# Altium schematic sheet ADC.SchDoc
size Tabloid; Organization: Altium Limited; Address1: L3, 12a Rodborough Rd; Address2: Frenchs Forest; Address3: NSW; Address4: Australia 2086
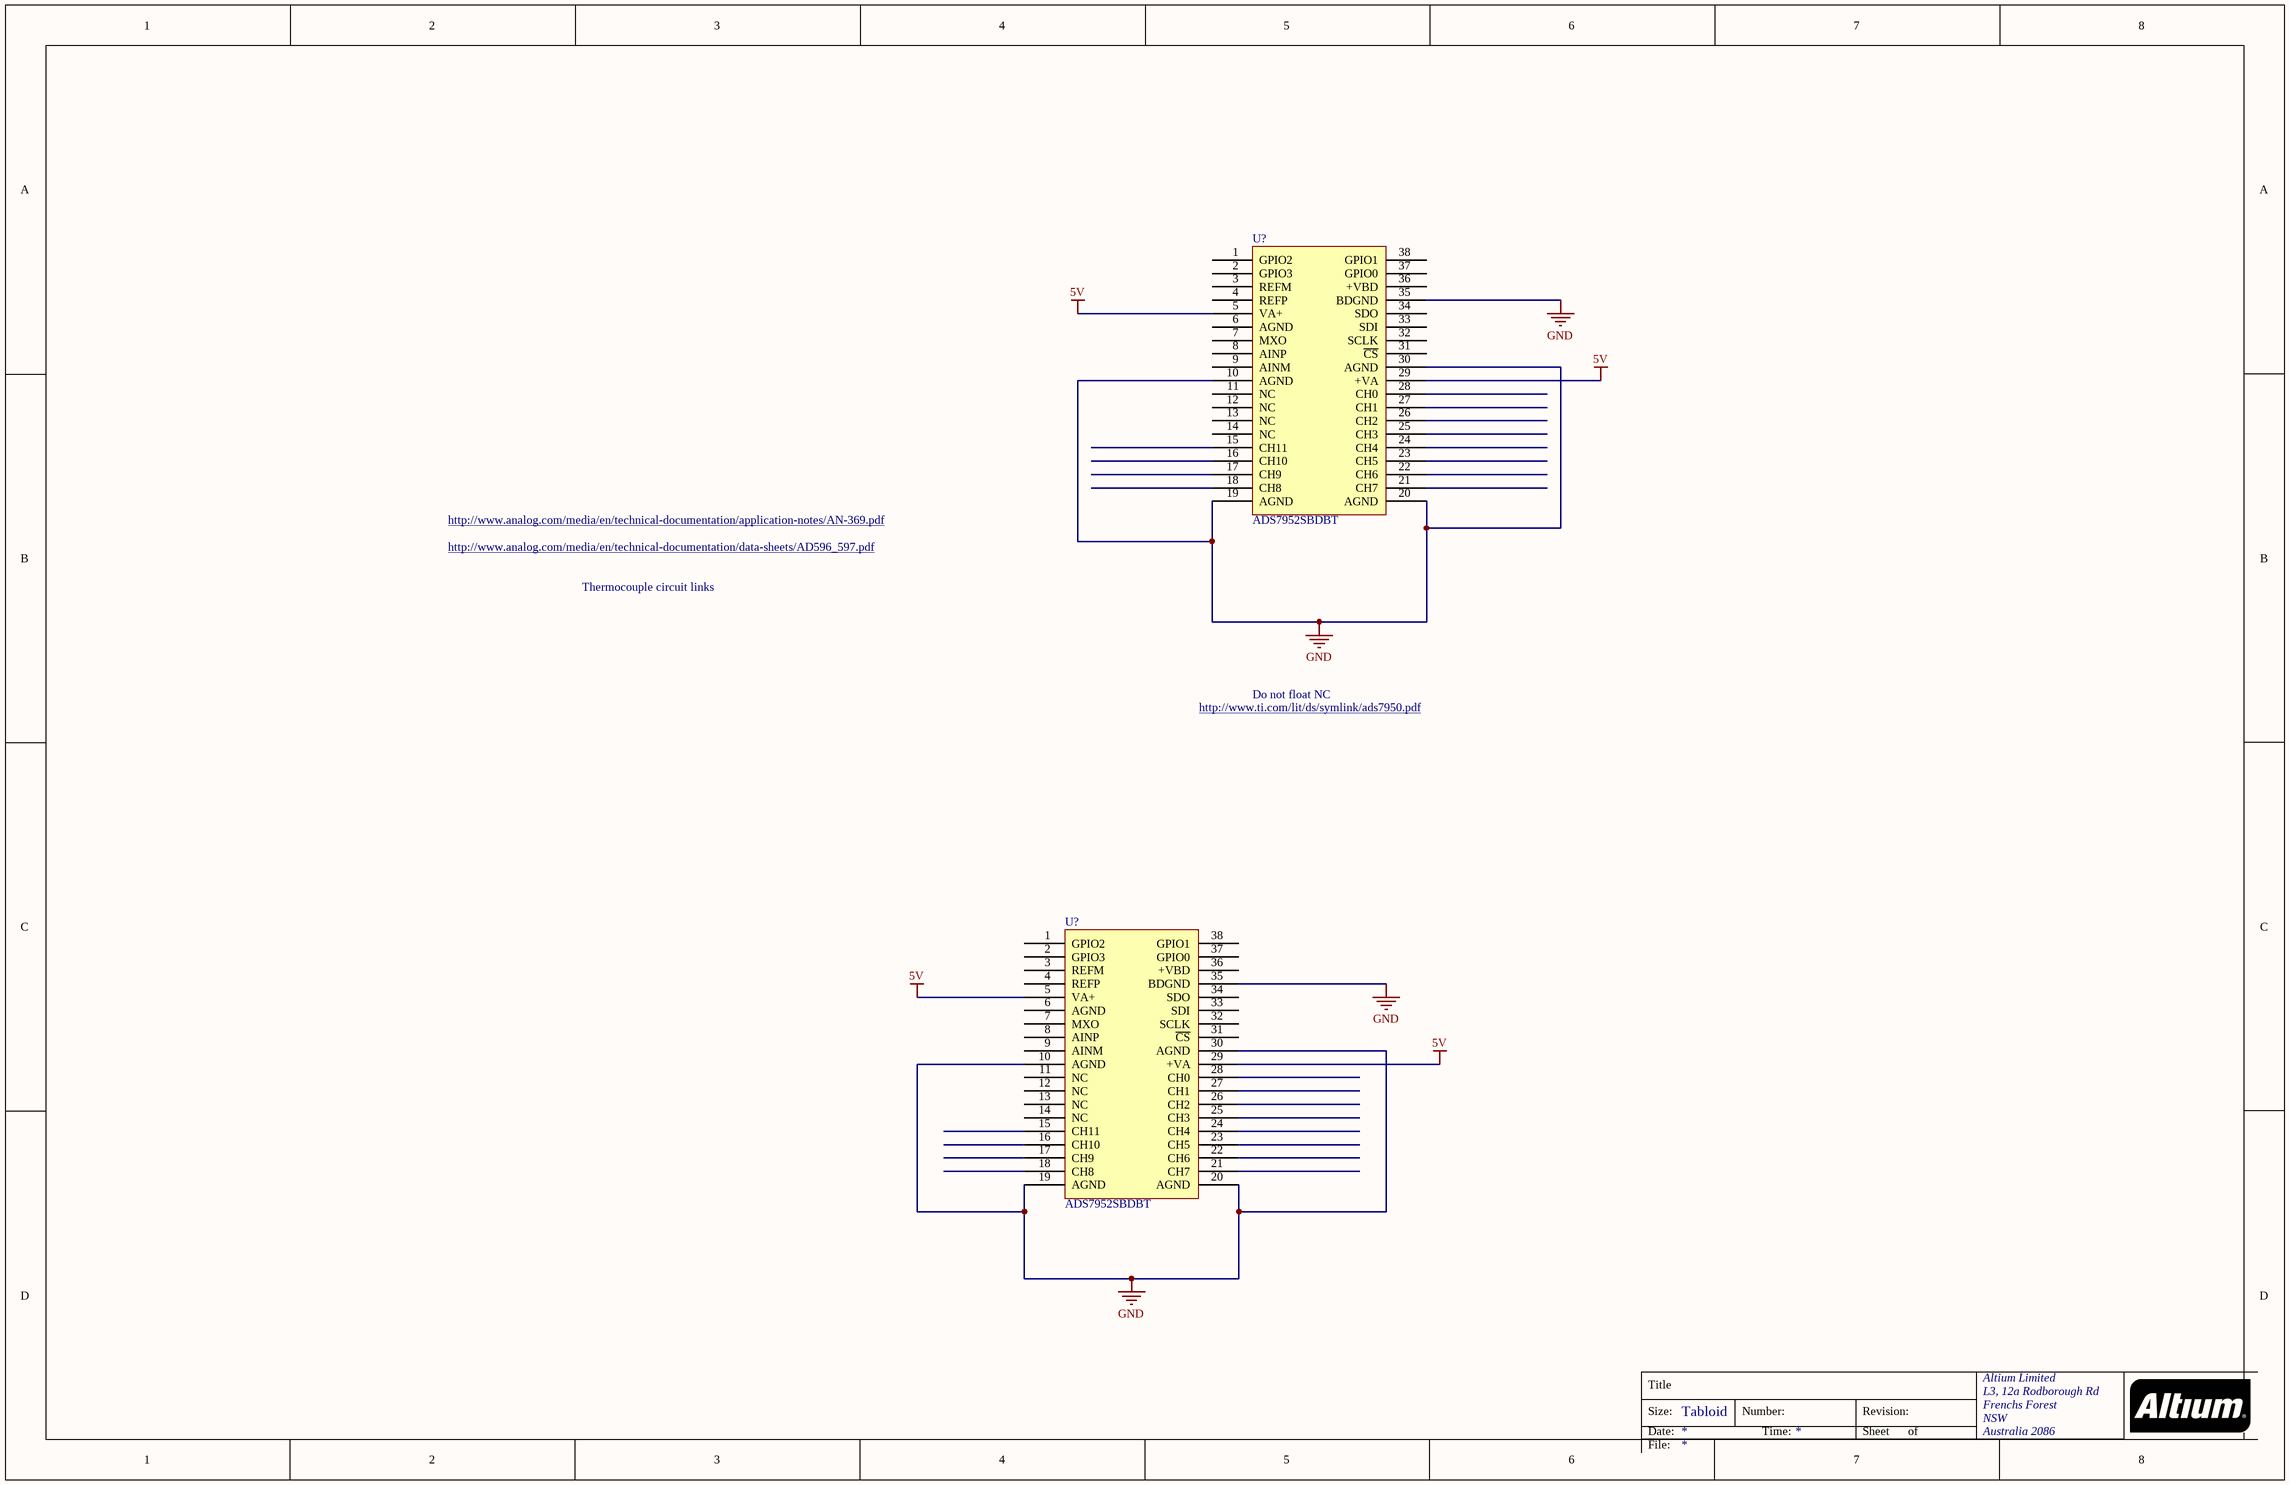
[diagram p0: ADC.SchDoc]

## Parts
(Parts that share a designator on the sheet are numbered #1, #2 ... from top to bottom, then left to right.)
U?#1  Manufacturer P/N: ADS7952SBDBT  [TSSOP50P640X120-38N]  (hidden comment: ADS7952)
U?#2  Manufacturer P/N: ADS7952SBDBT  [TSSOP50P640X120-38N]  (hidden comment: ADS7952)

## Nets
5V: U?#1.5(VA+) U?#1.29(+VA) U?#2.5(VA+) U?#2.29(+VA)
GND: U?#1.10(AGND) U?#1.19(AGND) U?#1.20(AGND) U?#1.30(AGND) U?#1.35(BDGND) U?#2.10(AGND) U?#2.19(AGND) U?#2.20(AGND) U?#2.30(AGND) U?#2.35(BDGND)

Not connected (* = marked no-connect by the designer): U?#1 1(GPIO2) 2(GPIO3) 3(REFM) 4(REFP) 6(AGND) 7(MXO) 8(AINP) 9(AINM) 11(NC) 12(NC) 13(NC) 14(NC) 15(CH11) 16(CH10) 17(CH9) 18(CH8) 21(CH7) 22(CH6) 23(CH5) 24(CH4) 25(CH3) 26(CH2) 27(CH1) 28(CH0) 31(~{CS}) 32(SCLK) 33(SDI) 34(SDO) 36(+VBD) 37(GPIO0) 38(GPIO1); U?#2 1(GPIO2) 2(GPIO3) 3(REFM) 4(REFP) 6(AGND) 7(MXO) 8(AINP) 9(AINM) 11(NC) 12(NC) 13(NC) 14(NC) 15(CH11) 16(CH10) 17(CH9) 18(CH8) 21(CH7) 22(CH6) 23(CH5) 24(CH4) 25(CH3) 26(CH2) 27(CH1) 28(CH0) 31(~{CS}) 32(SCLK) 33(SDI) 34(SDO) 36(+VBD) 37(GPIO0) 38(GPIO1)

## Notes on the sheet
- http://www.analog.com/media/en/technical-documentation/application-notes/AN-369.pdf
- http://www.analog.com/media/en/technical-documentation/data-sheets/AD596_597.pdf
- Thermocouple circuit links
- Do not float NC
- http://www.ti.com/lit/ds/symlink/ads7950.pdf
- Title
- Size:
- Date:
- Tabloid
- Number:
- Time:
- Revision:
- Sheet
- of
- File:

## Library data of the parts
U?#1 U?#2 = ADS7952: ADC; Manufacturer: Texas Instrument; Package: TSSOP-38; Digikey P/N: 296-23502-5-ND